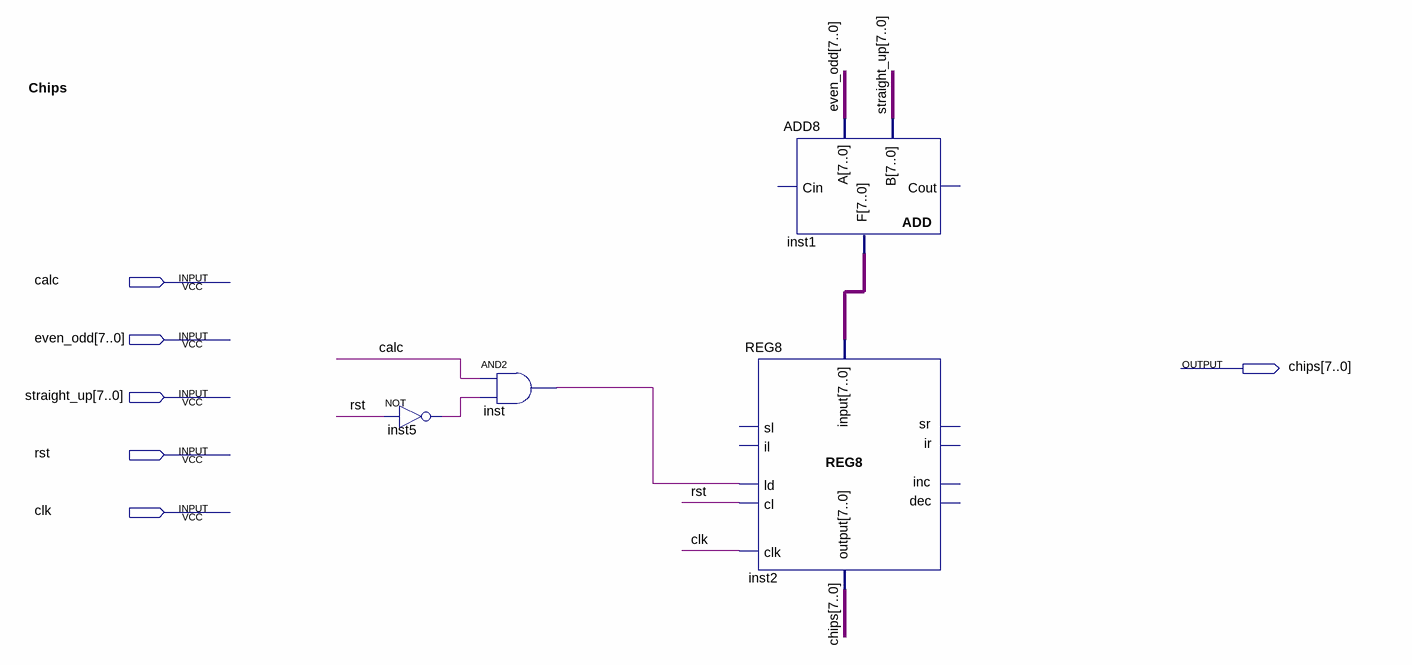
[diagram p0: schematic sheet]
// Quartus schematic Chips.bdf as structural Verilog: 4 symbols, 6 pins
module Chips (
  input  calc,
  input  [7:0] even_odd,
  input  [7:0] straight_up,
  input  rst,
  input  clk,
  output [7:0] chips
);

  wire inst5_out, inst_out;
  wire [7:0] inst1_f;

  not inst5 (inst5_out, rst);
  and inst (inst_out, calc, inst5_out);
  REG8 inst2 (
    .clk(clk), .ld(inst_out), .\input (inst1_f), .cl(rst), .\output (chips));  // open: sr, ir, sl, il, inc, dec
  ADD8 inst1 (.A(even_odd), .B(straight_up), .F(inst1_f));  // open: Cin, Cout

  // Notes on the sheet:
  //   Chips
endmodule
